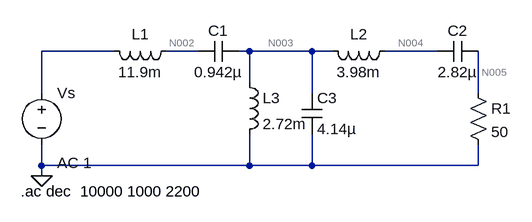
[diagram p0: schematic (2)ButBPF.asc]
(2)ButBPF.asc, the LTspice schematic file:
Version 4
SHEET 1 880 680
WIRE 112 48 0 48
WIRE 240 48 192 48
WIRE 320 48 304 48
WIRE 416 48 320 48
WIRE 448 48 416 48
WIRE 608 48 528 48
WIRE 320 96 320 48
WIRE 0 112 0 48
WIRE 416 112 416 48
WIRE 672 112 672 48
WIRE 0 224 0 192
WIRE 320 224 320 176
WIRE 320 224 0 224
WIRE 416 224 416 176
WIRE 416 224 320 224
WIRE 672 224 672 192
WIRE 672 224 416 224
WIRE 0 240 0 224
FLAG 0 240 0
SYMBOL voltage 0 96 R0
WINDOW 123 24 124 Left 2
WINDOW 39 0 0 Left 2
SYMATTR Value2 AC 1
SYMATTR InstName Vs
SYMATTR Value ""
SYMBOL ind 208 32 R90
WINDOW 0 5 56 VBottom 2
WINDOW 3 32 56 VTop 2
SYMATTR InstName L1
SYMATTR Value 11.9m
SYMBOL ind 544 32 R90
WINDOW 0 5 56 VBottom 2
WINDOW 3 32 56 VTop 2
SYMATTR InstName L2
SYMATTR Value 3.98m
SYMBOL res 656 96 R0
SYMATTR InstName R1
SYMATTR Value 50
SYMBOL cap 400 112 R0
SYMATTR InstName C3
SYMATTR Value 4.14µ
SYMBOL cap 304 32 R90
WINDOW 0 0 32 VBottom 2
WINDOW 3 32 32 VTop 2
SYMATTR InstName C1
SYMATTR Value 0.942µ
SYMBOL ind 304 80 R0
SYMATTR InstName L3
SYMATTR Value 2.72m
SYMBOL cap 672 32 R90
WINDOW 0 0 32 VBottom 2
WINDOW 3 32 32 VTop 2
SYMATTR InstName C2
SYMATTR Value 2.82µ
TEXT -32 264 Left 2 !.ac dec  10000 1000 2200

The netlist it stands for:
* (2)ButBPF.asc
Vs N001 0 AC 1
L1 N002 N001 11.9m
L2 N004 N003 3.98m
R1 N005 0 50
C3 N003 0 4.14µ
C1 N003 N002 0.942µ
L3 N003 0 2.72m
C2 N005 N004 2.82µ
.ac dec  10000 1000 2200
.backanno
.end

* Results of the author's LTspice run, read from the files saved beside the schematic
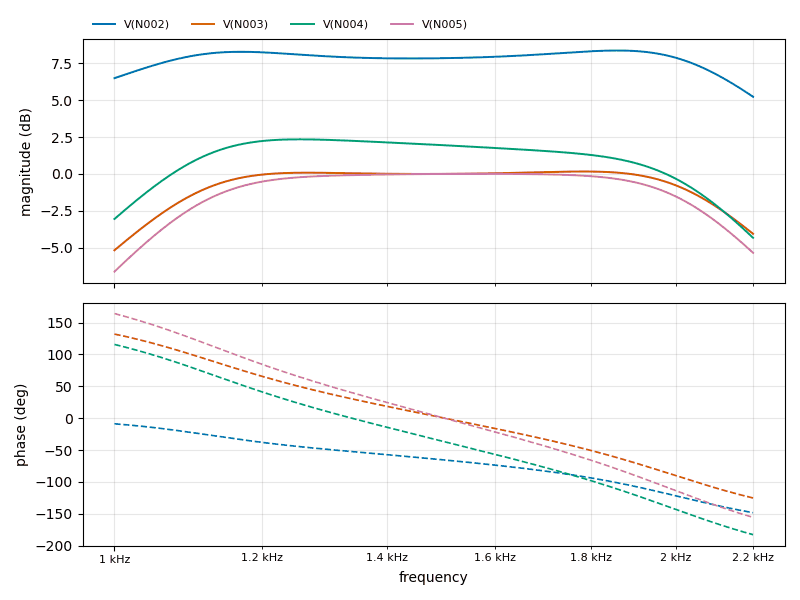
[diagram p1: AC Analysis of (2)ButBPF.asc, plotted from the saved traces]
* AC Analysis, 1 run:
*   V(N002): 6.49 dB at 1 kHz, 5.23 dB at 2.2 kHz, peak 8.37 dB at 1.86 kHz, 3 dB below the peak at 2.192 kHz
*   V(N003): -5.18 dB at 1 kHz, -4.06 dB at 2.2 kHz, peak 0.16 dB at 1.784 kHz, 3 dB below the peak at 1.055 kHz and 2.137 kHz
*   V(N004): -3.05 dB at 1 kHz, -4.33 dB at 2.2 kHz, peak 2.34 dB at 1.257 kHz, 3 dB below the peak at 1.055 kHz and 2.022 kHz
*   V(N005): -6.62 dB at 1 kHz, -5.35 dB at 2.2 kHz, peak 0.01 dB at 1.561 kHz, 3 dB below the peak at 1.08 kHz and 2.09 kHz